# Altium schematic sheet MCU047F_Main.SchDoc: Main Sheet
size 558 x 431 mm; Date: Not shown in title block; ApprovedBy: Not shown in title block; CheckedBy: Not shown in title block; Author: Not shown in title block; CompanyName: Not shown in title block; Engineer: Not shown in title block; Organization: Not shown in title block; Address1: Not shown in title block; Address2: Not shown in title block; Address3: Not shown in title block; Address4: Not shown in title block; DocumentNumber: 1; Revision: Use project parameter SCH_Rev; SheetNumber: 1; SheetTotal: 2; PageSetup: Record=PageOptions|CenterHorizontal=True|CenterVertical=True|PrintScale=1.00|XCorrection=1.00|YCorrection=1.00|PrintKind=0|BorderSize=5000000|LeftOffset=0|BottomOffset=0|Orientation=2|PaperLength=1000|PaperWidth=1000|Scale=100|PaperSource=15|PrintQuality=600|MediaType=1|DitherType=10|PaperKind=Letter|PrintScaleMode=1; CurrentTime: Not shown in title block; CurrentDate: Not shown in title block; Time: Not shown in title block; DocumentFullPathAndName: Not shown in title block; DocumentName: Not shown in title block; ModifiedDate: Not shown in title block; ImagePath: Not shown in title block
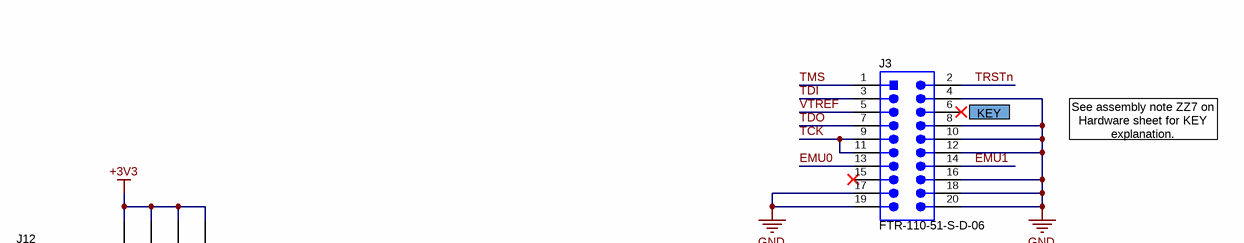
[diagram p0: MCU047F_Main.SchDoc, top left]
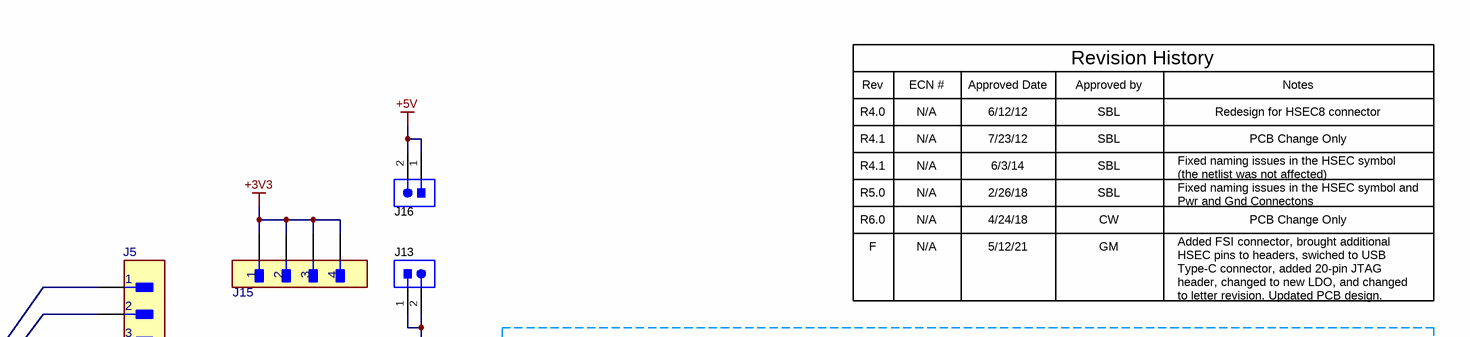
[diagram p1: MCU047F_Main.SchDoc, top right]
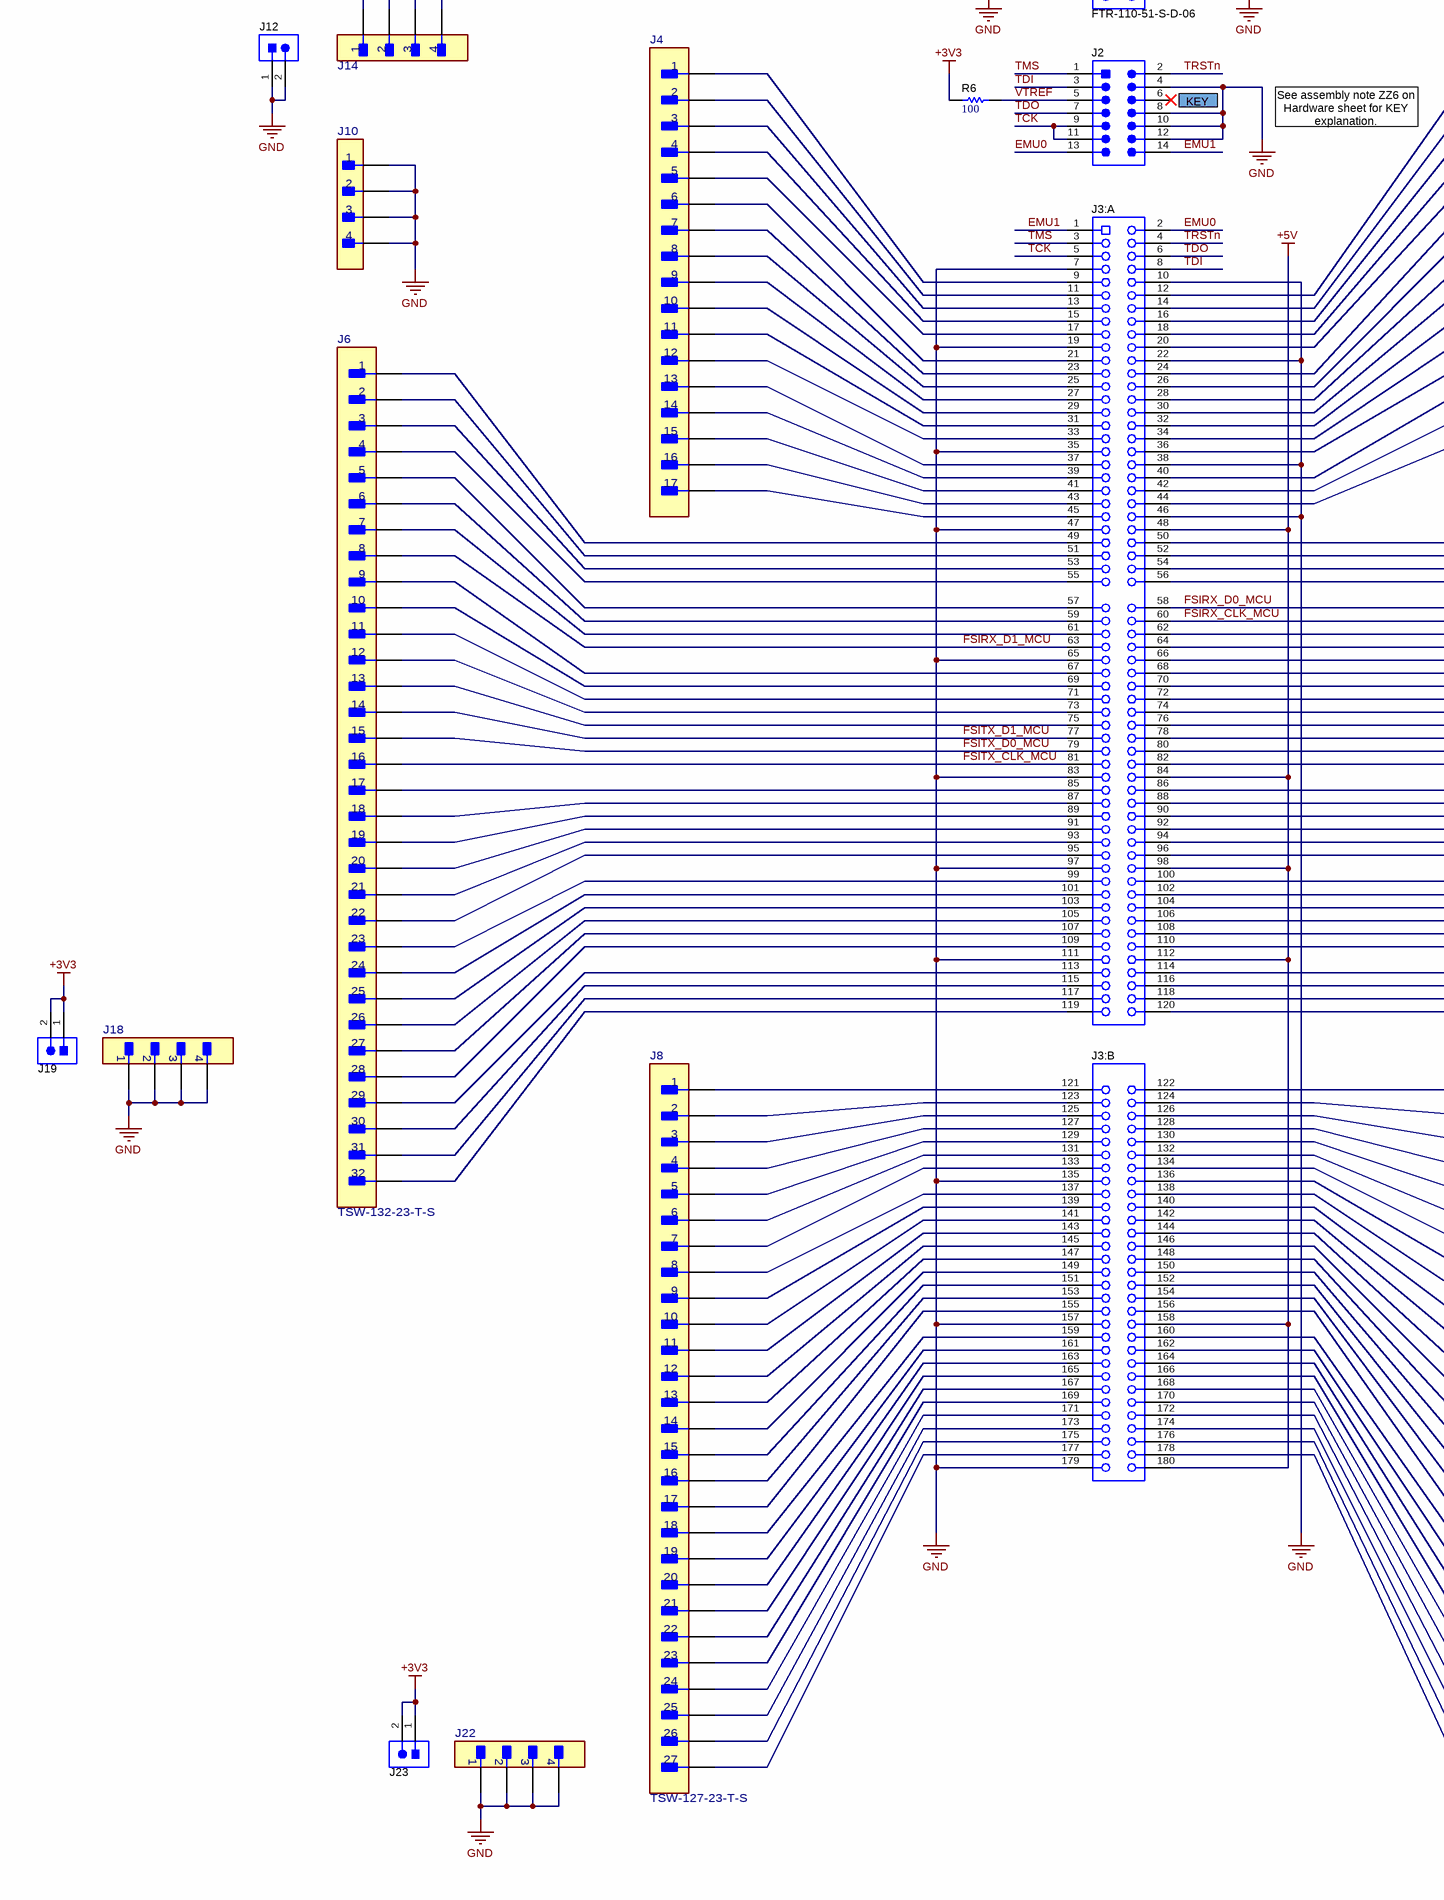
[diagram p2: MCU047F_Main.SchDoc, bottom left]
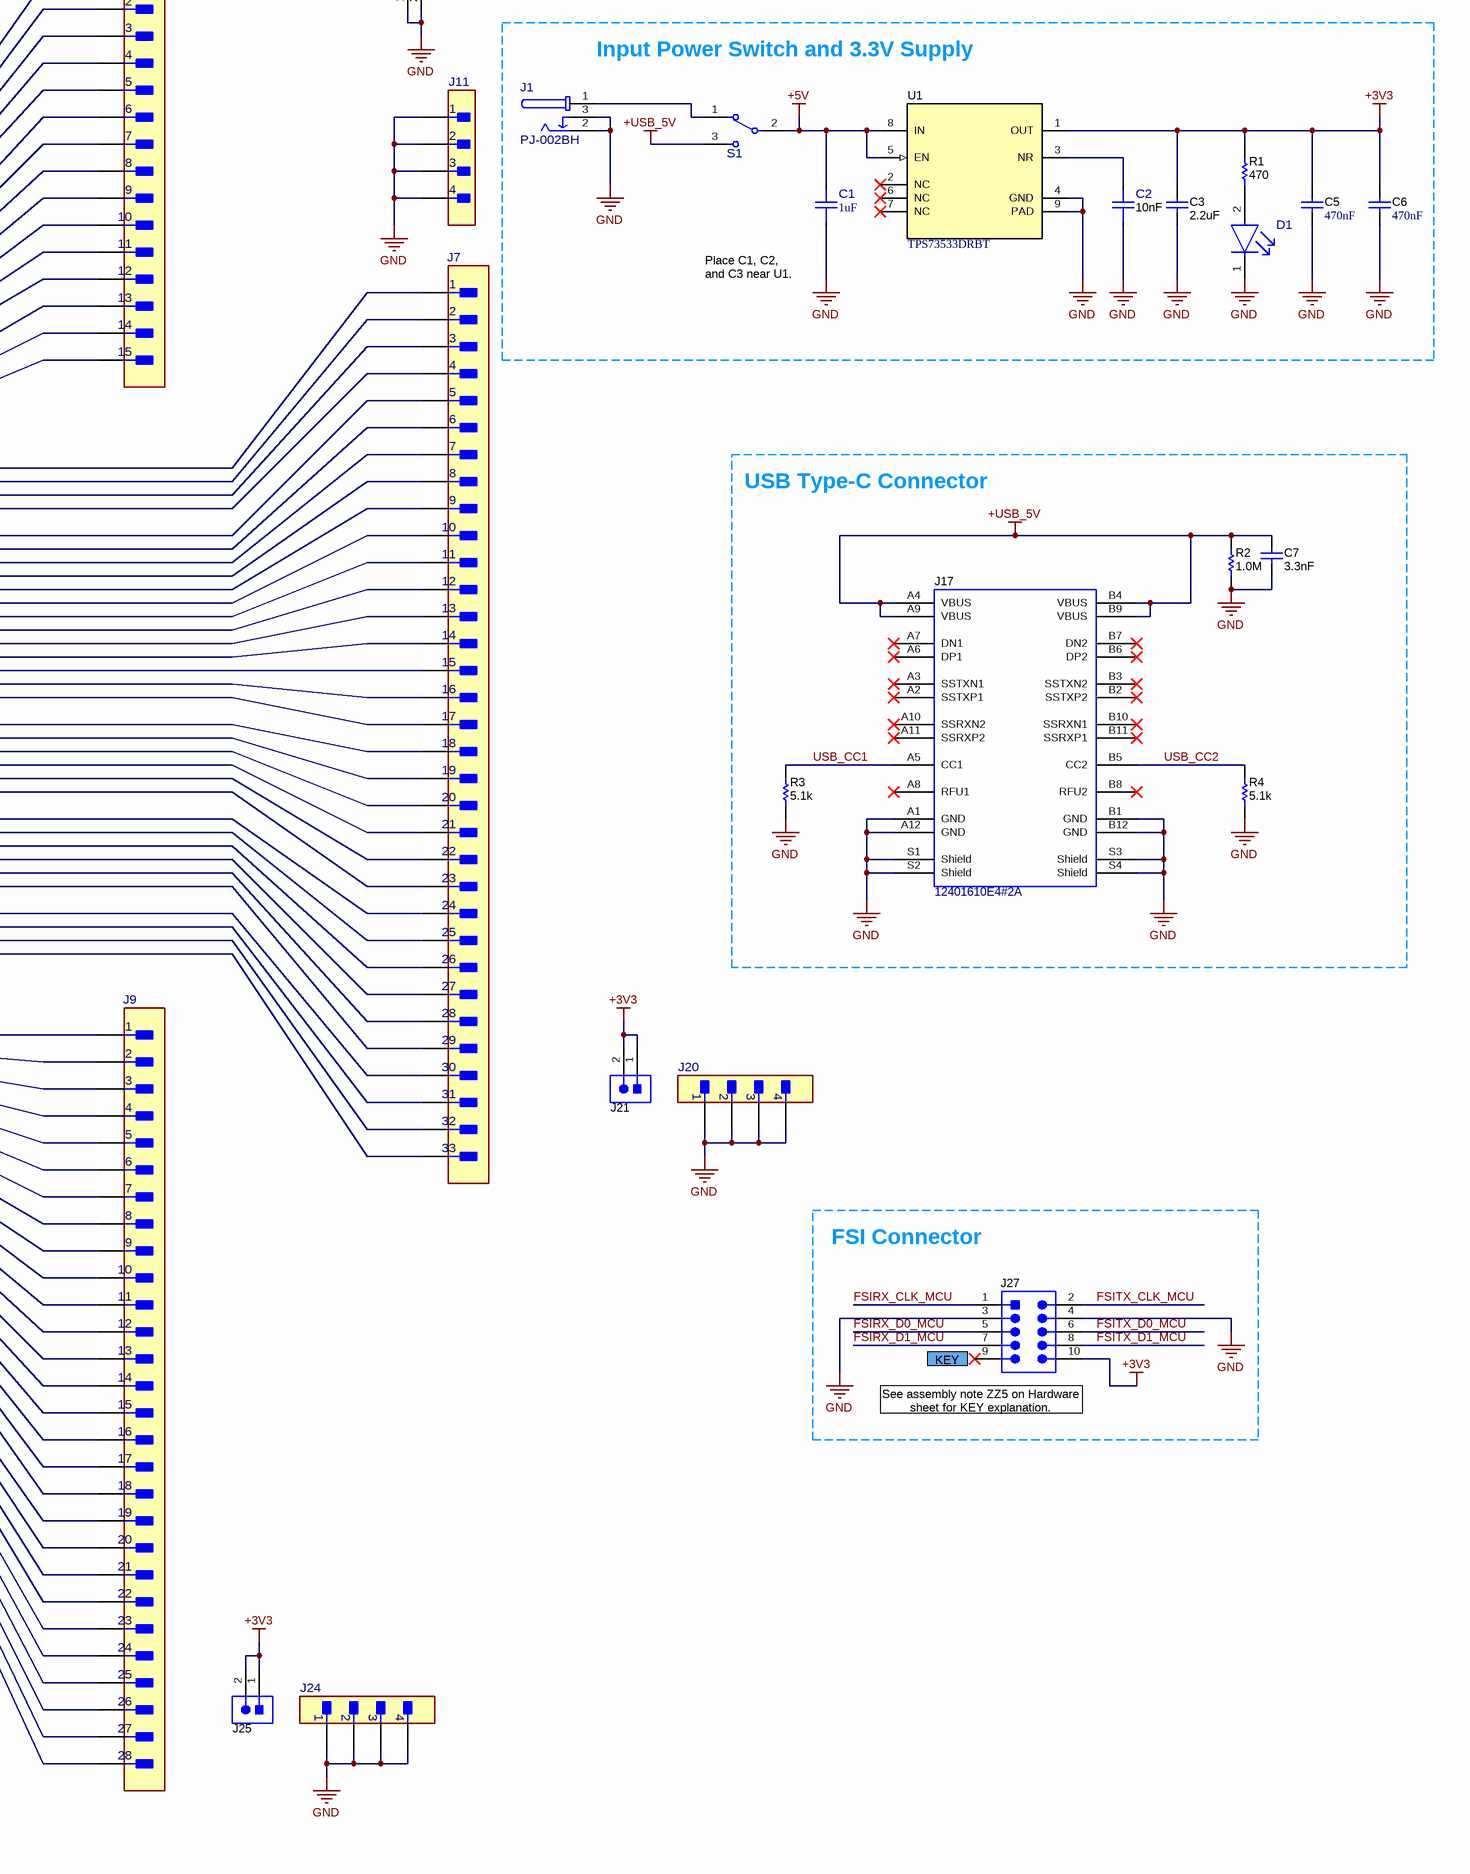
[diagram p3: MCU047F_Main.SchDoc, bottom right]

## Parts
C1  ValueDisplayed: 1uF  [FP-C0603C105K8PAC7411_0603-MFG]  (hidden comment: C0603C105K8PAC7411)
C2  Cap_F: 10nF  [FP-C0603C103K9RACTU_0603-MFG]  (hidden comment: C0603C103K9RACTU)
C3  ValueDisplayed: 2.2uF  [0603]  (hidden comment: JMK107BJ225KAHT)
C5  Cap_F: 470nF  [0805_HV]  (hidden comment: 0805YC474KAT2A)
C6  Cap_F: 470nF  [0805_HV]  (hidden comment: 0805YC474KAT2A)
C7  Cap_F: 3.3nF  [0805_HV]  (hidden comment: C0805C332K5RACTU)
D1  PG1112H-TR  [FP-PG1112H-TR_0805-MFG]  (value not drawn)
J1  PJ-002BH  [FP-PJ-002BH_PTH_POWER_CONN_14MM4_9MM0-MFG]
J2  61301421121  [Wurth_61301421121]  (value not drawn)
J3  FTR-110-51-S-D-06  [Samtec_FTR-110-51-x-D-06]
J3:A  HSEC8-160-01-L-DV-A-BL  [controlCARD-120HSEC]  (value not drawn)
J3:B  HSEC8-130-01-L-DV-A  [controlCARD-180HSEC-60pinAddon]  (value not drawn)
J4  TSW-117-23-T-S  [FP-TSW-117-23-T-S_HDR17-MFG]  (value not drawn)
J5  TSW-115-23-T-S  [FP-TSW-115-23-T-S_HDR15-MFG]  (value not drawn)
J6  TSW-132-23-T-S  [FP-TSW-132-23-T-S_HDR32-MFG]
J7  TSW-133-23-T-S  [FP-TSW-133-23-T-S_HDR33-MFG]  (value not drawn)
J8  TSW-127-23-T-S  [FP-TSW-127-23-T-S_HDR27-MFG]
J9  TSW-128-23-T-S  [FP-TSW-128-23-T-S_HDR28-0]  (value not drawn)
J10  TSW-104-23-T-S  [FP-TSW-104-23-T-S_HDR4-MFG]  (value not drawn)
J11  TSW-104-23-T-S  [FP-TSW-104-23-T-S_HDR4-MFG]  (value not drawn)
J12  TSW-102-23-T-S  [Samtec_TSW-102-23-X-S]  (value not drawn)
J13  TSW-102-23-T-S  [Samtec_TSW-102-23-X-S]  (value not drawn)
J14  TSW-104-23-T-S  [FP-TSW-104-23-T-S_HDR4-MFG]  (value not drawn)
J15  TSW-104-23-T-S  [FP-TSW-104-23-T-S_HDR4-MFG]  (value not drawn)
J16  TSW-102-23-T-S  [Samtec_TSW-102-23-X-S]  (value not drawn)
J17  12401610E4#2A  [Amphenol_12401610E4_2A]
J18  TSW-104-23-T-S  [FP-TSW-104-23-T-S_HDR4-MFG]  (value not drawn)
J19  TSW-102-23-T-S  [Samtec_TSW-102-23-X-S]  (value not drawn)
J20  TSW-104-23-T-S  [FP-TSW-104-23-T-S_HDR4-MFG]  (value not drawn)
J21  TSW-102-23-T-S  [Samtec_TSW-102-23-X-S]  (value not drawn)
J22  TSW-104-23-T-S  [FP-TSW-104-23-T-S_HDR4-MFG]  (value not drawn)
J23  TSW-102-23-T-S  [Samtec_TSW-102-23-X-S]  (value not drawn)
J24  TSW-104-23-T-S  [FP-TSW-104-23-T-S_HDR4-MFG]  (value not drawn)
J25  TSW-102-23-T-S  [Samtec_TSW-102-23-X-S]  (value not drawn)
J27  TSW-105-07-G-D  [TSW-105-07-G-D]  (value not drawn)
R1  ValueDisplayed: 470  [0805_HV]  (hidden comment: ERJ-6GEYJ471V)
R2  ValueDisplayed: 1.0M  [0805_HV]  (hidden comment: ERJ-6GEYJ105V)
R3  ValueDisplayed: 5.1k  [0805_HV]  (hidden comment: ERJ-6GEYJ512V)
R4  ValueDisplayed: 5.1k  [0805_HV]  (hidden comment: ERJ-6GEYJ512V)
R6  ValueDisplayed: 100  [0805_HV]  (hidden comment: ERJ-6GEYJ101V)
S1  200AWMSP1T1A1M2QE  [FP-200AWMSP1T1A1M2QE_PTH_SW_8MM13_5MM08-MFG]  (value not drawn)
U1  TPS73533DRBT  [DRB0008A]

## Nets
+3V3: C3.2 C5.1 C6.1 J14.1 J14.2 J14.3 J14.4 J15.1 J15.2 J15.3 J15.4 J19.1 J19.2 J21.1 J21.2 J23.1 J23.2 J25.1 J25.2 J27.10 R1.2 R6.1 U1.1(OUT)
+5V: C1.2 J3:A.48 J3:A.84 J3:A.98 J3:A.112 J3:B.158 J3:B.180 J16.1 J16.2 S1.2(COM) U1.5(EN) U1.8(IN)
+USB_5V: C7.1 J17.A4(VBUS) J17.A9(VBUS) J17.B4(VBUS) J17.B9(VBUS) R2.2 S1.3
GND: C1.1 C2.1 C3.1 C5.2 C6.2 C7.2 D1.1(CATHODE) J1.2 J1.3 J2.4 J2.8 J2.10 J2.12 J3.4 J3.8 J3.10 J3.12 J3.16 J3.17 J3.18 J3.19 J3.20 J3:A.7 J3:A.10 J3:A.19 J3:A.22 J3:A.35 J3:A.38 J3:A.46 J3:A.47 J3:A.65 J3:A.83 J3:A.97 J3:A.111 J3:B.135 J3:B.157 J3:B.179 J10.1 J10.2 J10.3 J10.4 J11.1 J11.2 J11.3 J11.4 J12.1 J12.2 J13.1 J13.2 J17.A1(GND) J17.A12(GND) J17.B1(GND) J17.B12(GND) J17.S1(Shield) J17.S2(Shield) J17.S3(Shield) J17.S4(Shield) J18.1 J18.2 J18.3 J18.4 J20.1 J20.2 J20.3 J20.4 J22.1 J22.2 J22.3 J22.4 J24.1 J24.2 J24.3 J24.4 J27.3 J27.4 R2.1 R3.1 R4.1 U1.4(GND) U1.9(PAD)
EMU0: J2.13 J3.13 J3:A.2
EMU1: J2.14 J3.14 J3:A.1
FSIRX_CLK_MCU: J3:A.60 J7.6 J27.1
FSIRX_D0_MCU: J3:A.58 J7.5 J27.5
FSIRX_D1_MCU: J3:A.63 J6.8 J27.7
FSITX_CLK_MCU: J3:A.81 J6.16 J27.2
FSITX_D0_MCU: J3:A.79 J6.15 J27.6
FSITX_D1_MCU: J3:A.77 J6.14 J27.8
TCK: J2.9 J2.11 J3.9 J3.11 J3:A.5
TDI: J2.3 J3.3 J3:A.8
TDO: J2.7 J3.7 J3:A.6
TMS: J2.1 J3.1 J3:A.3
TRSTn: J2.2 J3.2 J3:A.4
USB_CC1: J17.A5(CC1) R3.2
USB_CC2: J17.B5(CC2) R4.2
VTREF: J2.5 J3.5 R6.2
NetC2_2: C2.2 U1.3(NR)
NetD1_2: D1.2(ANODE) R1.1
NetJ1_1: J1.1 S1.1
NetJ3:A_9: J3:A.9 J4.1
NetJ3:A_11: J3:A.11 J4.2
NetJ3:A_12: J3:A.12 J5.1
NetJ3:A_13: J3:A.13 J4.3
NetJ3:A_14: J3:A.14 J5.2
NetJ3:A_15: J3:A.15 J4.4
NetJ3:A_16: J3:A.16 J5.3
NetJ3:A_17: J3:A.17 J4.5
NetJ3:A_18: J3:A.18 J5.4
NetJ3:A_20: J3:A.20 J5.5
NetJ3:A_21: J3:A.21 J4.6
NetJ3:A_23: J3:A.23 J4.7
NetJ3:A_24: J3:A.24 J5.6
NetJ3:A_25: J3:A.25 J4.8
NetJ3:A_26: J3:A.26 J5.7
NetJ3:A_27: J3:A.27 J4.9
NetJ3:A_28: J3:A.28 J5.8
NetJ3:A_29: J3:A.29 J4.10
NetJ3:A_30: J3:A.30 J5.9
NetJ3:A_31: J3:A.31 J4.11
NetJ3:A_32: J3:A.32 J5.10
NetJ3:A_33: J3:A.33 J4.12
NetJ3:A_34: J3:A.34 J5.11
NetJ3:A_36: J3:A.36 J5.12
NetJ3:A_37: J3:A.37 J4.13
NetJ3:A_39: J3:A.39 J4.14
NetJ3:A_40: J3:A.40 J5.13
NetJ3:A_41: J3:A.41 J4.15
NetJ3:A_42: J3:A.42 J5.14
NetJ3:A_43: J3:A.43 J4.16
NetJ3:A_44: J3:A.44 J5.15
NetJ3:A_45: J3:A.45 J4.17
NetJ3:A_49: J3:A.49 J6.1
NetJ3:A_50: J3:A.50 J7.1
NetJ3:A_51: J3:A.51 J6.2
NetJ3:A_52: J3:A.52 J7.2
NetJ3:A_53: J3:A.53 J6.3
NetJ3:A_54: J3:A.54 J7.3
NetJ3:A_55: J3:A.55 J6.4
NetJ3:A_56: J3:A.56 J7.4
NetJ3:A_57: J3:A.57 J6.5
NetJ3:A_59: J3:A.59 J6.6
NetJ3:A_61: J3:A.61 J6.7
NetJ3:A_62: J3:A.62 J7.7
NetJ3:A_64: J3:A.64 J7.8
NetJ3:A_66: J3:A.66 J7.9
NetJ3:A_67: J3:A.67 J6.9
NetJ3:A_68: J3:A.68 J7.10
NetJ3:A_69: J3:A.69 J6.10
NetJ3:A_70: J3:A.70 J7.11
NetJ3:A_71: J3:A.71 J6.11
NetJ3:A_72: J3:A.72 J7.12
NetJ3:A_73: J3:A.73 J6.12
NetJ3:A_74: J3:A.74 J7.13
NetJ3:A_75: J3:A.75 J6.13
NetJ3:A_76: J3:A.76 J7.14
NetJ3:A_78: J3:A.78 J7.15
NetJ3:A_80: J3:A.80 J7.16
NetJ3:A_82: J3:A.82 J7.17
NetJ3:A_85: J3:A.85 J6.17
NetJ3:A_86: J3:A.86 J7.18
NetJ3:A_87: J3:A.87 J6.18
NetJ3:A_88: J3:A.88 J7.19
NetJ3:A_89: J3:A.89 J6.19
NetJ3:A_90: J3:A.90 J7.20
NetJ3:A_91: J3:A.91 J6.20
NetJ3:A_92: J3:A.92 J7.21
NetJ3:A_93: J3:A.93 J6.21
NetJ3:A_94: J3:A.94 J7.22
NetJ3:A_95: J3:A.95 J6.22
NetJ3:A_96: J3:A.96 J7.23
NetJ3:A_99: J3:A.99 J6.23
NetJ3:A_100: J3:A.100 J7.24
NetJ3:A_101: J3:A.101 J6.24
NetJ3:A_102: J3:A.102 J7.25
NetJ3:A_103: J3:A.103 J6.25
NetJ3:A_104: J3:A.104 J7.26
NetJ3:A_105: J3:A.105 J6.26
NetJ3:A_106: J3:A.106 J7.27
NetJ3:A_107: J3:A.107 J6.27
NetJ3:A_108: J3:A.108 J7.28
NetJ3:A_109: J3:A.109 J6.28
NetJ3:A_110: J3:A.110 J7.29
NetJ3:A_113: J3:A.113 J6.29
NetJ3:A_114: J3:A.114 J7.30
NetJ3:A_115: J3:A.115 J6.30
NetJ3:A_116: J3:A.116 J7.31
NetJ3:A_117: J3:A.117 J6.31
NetJ3:A_118: J3:A.118 J7.32
NetJ3:A_119: J3:A.119 J6.32
NetJ3:A_120: J3:A.120 J7.33
NetJ3:B_121: J3:B.121 J8.1
NetJ3:B_122: J3:B.122 J9.1
NetJ3:B_123: J3:B.123 J8.2
NetJ3:B_124: J3:B.124 J9.2
NetJ3:B_125: J3:B.125 J8.3
NetJ3:B_126: J3:B.126 J9.3
NetJ3:B_127: J3:B.127 J8.4
NetJ3:B_128: J3:B.128 J9.4
NetJ3:B_129: J3:B.129 J8.5
NetJ3:B_130: J3:B.130 J9.5
NetJ3:B_131: J3:B.131 J8.6
NetJ3:B_132: J3:B.132 J9.6
NetJ3:B_133: J3:B.133 J8.7
NetJ3:B_134: J3:B.134 J9.7
NetJ3:B_136: J3:B.136 J9.8
NetJ3:B_137: J3:B.137 J8.8
NetJ3:B_138: J3:B.138 J9.9
NetJ3:B_139: J3:B.139 J8.9
NetJ3:B_140: J3:B.140 J9.10
NetJ3:B_141: J3:B.141 J8.10
NetJ3:B_142: J3:B.142 J9.11
NetJ3:B_143: J3:B.143 J8.11
NetJ3:B_144: J3:B.144 J9.12
NetJ3:B_145: J3:B.145 J8.12
NetJ3:B_146: J3:B.146 J9.13
NetJ3:B_147: J3:B.147 J8.13
NetJ3:B_148: J3:B.148 J9.14
NetJ3:B_149: J3:B.149 J8.14
NetJ3:B_150: J3:B.150 J9.15
NetJ3:B_151: J3:B.151 J8.15
NetJ3:B_152: J3:B.152 J9.16
NetJ3:B_153: J3:B.153 J8.16
NetJ3:B_154: J3:B.154 J9.17
NetJ3:B_155: J3:B.155 J8.17
NetJ3:B_156: J3:B.156 J9.18
NetJ3:B_159: J3:B.159 J8.18
NetJ3:B_160: J3:B.160 J9.19
NetJ3:B_161: J3:B.161 J8.19
NetJ3:B_162: J3:B.162 J9.20
NetJ3:B_163: J3:B.163 J8.20
NetJ3:B_164: J3:B.164 J9.21
NetJ3:B_165: J3:B.165 J8.21
NetJ3:B_166: J3:B.166 J9.22
NetJ3:B_167: J3:B.167 J8.22
NetJ3:B_168: J3:B.168 J9.23
NetJ3:B_169: J3:B.169 J8.23
NetJ3:B_170: J3:B.170 J9.24
NetJ3:B_171: J3:B.171 J8.24
NetJ3:B_172: J3:B.172 J9.25
NetJ3:B_173: J3:B.173 J8.25
NetJ3:B_174: J3:B.174 J9.26
NetJ3:B_175: J3:B.175 J8.26
NetJ3:B_176: J3:B.176 J9.27
NetJ3:B_177: J3:B.177 J8.27
NetJ3:B_178: J3:B.178 J9.28

Not connected (* = marked no-connect by the designer): J2 6*; J3 6* 15*; J17 A2(SSTXP1)* A3(SSTXN1)* A6(DP1)* A7(DN1)* A8(RFU1)* A10(SSRXN2)* A11(SSRXP2)* B2(SSTXP2)* B3(SSTXN2)* B6(DP2)* B7(DN2)* B8(RFU2)* B10(SSRXN1)* B11(SSRXP1)*; J27 9*; U1 2(NC)* 6(NC)* 7(NC)*

## Notes on the sheet
- Rev
- ECN #
- Approved Date
- Approved by
- Revision History
- Notes
- (near J3) KEY
- See assembly note ZZ7 on Hardware sheet for KEY explanation.
- R4.1
- R4.0
- N/A
- 6/3/14
- 6/12/12
- 7/23/12
- SBL
- Redesign for HSEC8 connector
- PCB Change Only
- R5.0
- R6.0
- 2/26/18
- 4/24/18
- CW
- Fixed naming issues in the HSEC symbol
  (the netlist was not affected)
- Fixed naming issues in the HSEC symbol and Pwr and Gnd Connectons
- F
- 5/12/21
- GM
- Added FSI connector, brought additional HSEC pins to headers, swiched to USB Type-C connector, added 20-pin JTAG header, changed to new LDO, and changed to letter revision. Updated PCB design.
- (near J2) KEY
- See assembly note ZZ6 on Hardware sheet for KEY explanation.
- Input Power Switch and 3.3V Supply
- (near C1) Place C1, C2, and C3 near U1.
- USB Type-C Connector
- FSI Connector
- (near J27) See assembly note ZZ5 on Hardware sheet for KEY explanation.
- (near J27) KEY
- Drawn By:
- SVN Rev:
- Number:
- TID #:
- Orderable:
- Rev:
- Sheet Title:
- File:
- Project Title:
- Designed for:
- Assembly Variant:
- Mod. Date:
- Sheet:
- Size:
- of
- C
- http://www.ti.com
- Texas Instruments and/or its licensors do not warrant the accuracy or completeness of this specification or any information contained therein. Texas Instruments and/or its licensors do not warrant that this design will meet the specifications, will be suitable for your application or fit for any particular purpose, or will operate in an implementation. Texas Instruments and/or its licensors do not warrant that the design is production worthy. You should completely validate and test your design implementation to confirm the system functionality for your application.
- Engineer:
- Contact:
- © Texas Instruments

## Library data of the parts
C1 = CMP-0092650-1: 1uF ±10% 10V Ceramic Capacitor X5R 0603 (1608 Metric); Manufacturer: KEMET; TempCo: 15%; Value: 1µF; SizeZ_mm: 0.9mm; AEC Qualified: No; Supplier Part Number 2: 80-C0603C105K8PLR; Supplier 2: Mouser; RoHS: TRUE; Supplier 1: Digikey; PackageReference: 0603; Tolerance_%: 10%; PartNumber: C0603C105K8PAC7411; Cap_F: 1µF; VDC_V: 10V; ComponentLink1Description: Datasheet; Supplier Part Number 1: 399-C0603C105K8PAC7411CT-ND; ComponentLink1URL: https://content.kemet.com/datasheets/KEM_C1006_X5R_SMD.pdf; Digikey Description: CAP CER 1UF 10V X5R 0603; Lead Free: Yes; Operating Temperature Range: -55°C to +85°C; Mouser Description: Cap Ceramic 1uF 10V X5R 10% SMD 0603 85°C Paper T/R; Mouser Part Number: 80-C0603C105K8PLR; Digikey Part Number: 399-C0603C105K8PAC7411CT-ND; helpURL: https://upverter.com/upn/revision/5d383732cde16e16/; datasheet: https://content.kemet.com/datasheets/KEM_C1006_X5R_SMD.pdf; Part Number: C0603C105K8PAC7411; Temperature Characteristic: X5R; Datasheet Path: datasheets/Cap-C0603C105K8PAC7411.pdf
C2 = CMP-0091957-1: 10000pF ±10% 6.3V Ceramic Capacitor X7R 0603 (1608 Metric); Manufacturer: Kemet; AEC Qualified: No; Value: 10nF; ValueDisplayed: 0.01uF; SizeZ_mm: 0.87mm; RoHS: TRUE; Digikey Part Number: 399-8988-1-ND; helpURL: https://upverter.com/upn/revision/0cbf15b84dd4e6ff/; PackageReference: 0603; PartNumber: C0603C103K9RACTU; Supplier 2: Mouser; Digikey Description: CAP CER 10000PF 6.3V X7R 0603; Operating Temperature Range: -55°C to +125°C; Tolerance_%: 10%; ComponentLink1Description: Datasheet; Temperature Characteristic: X7R; Mouser Part Number: 80-C0603C103K9R; VDC_V: 6.3V; Supplier 1: Digikey; datasheet: https://content.kemet.com/datasheets/KEM_C1002_X7R_SMD.pdf; Mouser Description: Multilayer Ceramic Capacitors MLCC - SMD/SMT 6.3volts 10000pF X7R 10%; ComponentLink1URL: https://content.kemet.com/datasheets/KEM_C1002_X7R_SMD.pdf; Supplier Part Number 2: 80-C0603C103K9R; Supplier Part Number 1: 399-8988-1-ND; Datasheet Path: datasheets/Cap-C0603C103K9RACTU.pdf; Lead Free: Yes; Part Number: C0603C103K9RACTU
C3 = CMP-0007504-5: CAP, CERM, 2.2 uF, 6.3 V, +/- 10%, X5R, 0603; Manufacturer: Taiyo Yuden; TaMin_C: -55°C; Polarized: N; SizeAreaWB_mm2: 4.68; Value1: Unknown; U/M: EA; Value: 2.2uF; TaMax_C: 85°C; SizeZ_mm: 1; SizeX_mm: 1.6; SizeY_mm: 0.8; Value2: 6.3V; SizeArea_mm2: 1.28; Cap_F: 2.2µF; AEC Category: Q200; Supplier Part Number 2: 963-JMK107BJ225KAHT; Publisher: Texas Instruments; Supplier 2: Mouser; TempCo: X5R; Published: 2008-06-19; RoHS: Y; MountType: SMT; Supplier 1: Digi-Key; PackageReference: 0603; Tolerance_%: 10%; Cap_Case: 0603; CompType: Capacitor; LatestRevisionDate: 2017-03-09; PartNumber: JMK107BJ225KAHT; AEC Qualified: ?; VDC_V: 6.3V; ComponentLink1Description: Datasheet link; Supplier Part Number 1: 587-3386-1-ND; Technology: Ceramic; ComponentLink1URL: http://www.yuden.co.jp/productdata/catalog/en/mlcc101_e.pdf
C5 C6 = CMP-0007675-2: CAP, CERM, 0.47 uF, 16 V, +/- 10%, X7R, 0805; Manufacturer: AVX; TaMin_C: -55°C; ESR_ohm: 11m; Polarized: N; SizeAreaWB_mm2: 6.75; Value1: 0.011 ohm; U/M: EA; Value: 0.47uF; TaMax_C: 125°C; SizeZ_mm: 1.45; SizeX_mm: 2; SizeY_mm: 1.25; Cap_Case: 0805; Value2: 16V; SizeArea_mm2: 2.5; AEC Category: Q200; Supplier Part Number 2: 96K4765; Publisher: Texas Instruments; Supplier 2: Newark; Supplier Part Number 3: 581-080516C474K; TempCo: X7R; Supplier 3: Mouser; Published: 2008-06-19; RoHS: Y; MountType: SMT; Supplier 1: Digi-Key; PackageReference: 0805; Tolerance_%: 10%; CompType: Capacitor; LatestRevisionDate: 2017-03-09; PartNumber: 0805YC474KAT2A; AEC Qualified: N; VDC_V: 16V; ComponentLink1Description: Datasheet link; AEC Grade: N/A; Supplier Part Number 1: 478-1403-1-ND; Technology: Ceramic; ValueDisplayed: 0.47uF; ComponentLink1URL: http://datasheets.avx.com/X7RDielectric.pdf
C7 = CMP-0007785-2: CAP, CERM, 3300 pF, 50 V, +/- 10%, X7R, 0805; Manufacturer: Kemet; TaMin_C: -55°C; ESR_ohm: 0.332; Polarized: N; SizeAreaWB_mm2: 6.75; Value1: 0.332 ohm; U/M: EA; Value: 3300pF; TaMax_C: 125°C; SizeZ_mm: 1.45; SizeX_mm: 2; SizeY_mm: 1.25; Cap_Case: 0805; Value2: 50V; SizeArea_mm2: 2.5; IRMS_A: 319mA; AEC Category: Q200; Supplier Part Number 2: 64K2930; Publisher: Texas Instruments; Supplier 2: Newark; Supplier Part Number 3: 80-C0805C332K5R; TempCo: X7R; Supplier 3: Mouser; Published: 2008-06-19; RoHS: Y; MountType: SMT; Supplier 1: Digi-Key; PackageReference: 0805; Tolerance_%: 10%; CompType: Capacitor; LatestRevisionDate: 2017-03-09; PartNumber: C0805C332K5RACTU; AEC Qualified: ?; VDC_V: 50V; ComponentLink1Description: Datasheet link; Supplier Part Number 1: 399-1153-1-ND; Technology: Ceramic; ValueDisplayed: 3300pF; ComponentLink1URL: http://www.kemet.com/kemet/web/homepage/kechome.nsf/file/Partial%20Copy%20-%20Ceramic%20Surface%20Mount%20Capacitors/$file/F3102_CE.pdf
D1 = CMP-0091781-1: Green 567nm LED Indication - Discrete 2.1V 0805 (2012 Metric); Manufacturer: Stanley Electric Co; LambdaP: 560nm; SizeZ_mm: 0.9mm; Standoff Height: 0mm; Angle: 160°; Power_TotalModule: 70mW; Luminous Intensity: 6.4mcd; Forward Current: 20mA; Vr_V: 4V; Led Orientation: Top View; AEC Qualified: No; Mouser Part Number: 327-PG1112HTR; PackageReference: 0805; PartNumber: PG1112H-TR; datasheet: https://media.digikey.com/pdf/Data%20Sheets/Stanley%20Electric%20PDFs/BR1112H.pdf; Digikey Part Number: 404-1021-1-ND; Lead Free: yes; Color: Green; ComponentLink1URL: https://media.digikey.com/pdf/Data%20Sheets/Stanley%20Electric%20PDFs/BR1112H.pdf; helpURL: https://upverter.com/upn/revision/9b6f839920567d23/; Digikey Description: LED GREEN DIFFUSED 2125 SMD; ComponentLink1Description: Datasheet; LambdaD: 567nm; Part Number: PG1112H-TR; Vf_V: 2.1V; Operating Temperature Range: -30°C to +85°C; Datasheet Path: datasheets/Diode-PG1112H-TR.pdf; RoHS: TRUE
J1 = CMP-0091947-1: Manufacturer: CUI Devices; AEC Qualified: No; SizeZ_mm: 11.2mm; Conn Orientation: Right Angle; ContactFinish: Nickel; Voltage_V: 24V; Conn Gender: Male; Current_A: 5A; Part Number: PJ-002BH; Supplier Part Number 1: CP-002BH-ND; PackageReference: PTH_POWER_CONN_14MM4_9MM0; PartNumber: PJ-002BH; helpURL: https://upverter.com/upn/revision/c0ec03f34a1cebd9/; Supplier Part Number 2: 490-PJ-002BH; Operating Temperature Range: -25°C to +85°C; Mouser Description: 2.5 x 6.5 mm, 5.0 A, Horizontal, Through Hole, Dc Power Jack Connector; Digikey Description: CONN PWR JACK 2.5X5.5MM SOLDER; Digikey Part Number: CP-002BH-ND; ComponentLink1URL: https://www.cuidevices.com/product/resource/pj-002bh.pdf; Lead Free: Yes; Supplier 2: Mouser; RoHS: TRUE; Supplier 1: Digikey; datasheet: https://www.cuidevices.com/product/resource/pj-002bh.pdf; ComponentLink1Description: Datasheet; Datasheet Path: datasheets/Conn-PJ-002BH.pdf; PinCount: 1; Mouser Part Number: 490-PJ-002BH
J2 = CMP-0086014-1: Header, 2.54mm, 7x2, Gold, TH; Manufacturer: Wurth Elektronik; Pitch_mm: 2.54; Voltage_V: 250V; Shrouded: N; Gender: Male; Current_A: 3A; Cert_UL: Y; Row_Count: 2; CompType: Header; Color: Black; PackageReference: Header, 2.54mm, 7x2, TH; PinCount: 14; Orientation: Vertical; RoHS: Y; RowSpacing_mm: 2.54; ComponentLink1URL: https://katalog.we-online.de/em/datasheet/6130xx21121.pdf; ClassName: Header; ContactFinish: Gold; MountType: TH; ComponentLink1Description: Datasheet URL; PartNumber: 61301421121
J3 = CMP-0075640-2: Header, 1.27mm, 10x2, Tin, SMT; Manufacturer: Samtec; Pitch_mm: 1.27; Gender: Male; Cert_UL: Y; Green_REACh: Passed; Current_A: 3.1A; Shrouded: N; RowSpacing_mm: 2.54; Green_Lifecycle: Active; Row_Count: 2; ComponentLink1Description: Datasheet URL; RoHS: Y; Supplier 1: Digi-Key; Orientation: Vertical; Green_EU RoHS: Passed; PackageReference: Header, 1.27mm, 10x2, SMT; Color: Black; PartNumber: FTR-110-51-S-D-06; PinCount: 20; Supplier Part Number 2: 44W8888; ContactFinish: Tin; Supplier 2: Newark; ClassName: Header; ComponentLink1URL: http://suddendocs.samtec.com/prints/ftr-1xx-xx-xx-d-xx-xx-mkt.pdf; CompType: Header; MountType: SMT; Supplier Part Number 1: SAM8792-ND; Green_EU RoHS-2: Passed
J3:A = CMP-0003814-2: C2000 controlCARD-120HSEC connector, SMT; Manufacturer: Samtec; Note: The pin numbering does not match Samtec datasheet; ComponentLink1URL: http://www.samtec.com/ftppub/pdf/hsec8_dv.pdf; CompType: Connector; PackageReference: C2000 pin numbering; RoHS: Y; MountType: SMT; PartNumber: HSEC8-160-01-L-DV-A-BL; ComponentLink1Description: Datasheet Link
J3:B = CMP-0003859-2: C2000 controlCARD-180HSEC (60-pin addon) connector, SMT; Manufacturer: Samtec; Note: The pin numbering does not match Samtec datasheet; ComponentLink1URL: http://suddendocs.samtec.com/prints/hsec8-1xxx-xx-xx-dv-x-xx-mkt.pdf; CompType: Connector; PackageReference: C2000 pin numbering; RoHS: Y; MountType: SMT; PartNumber: HSEC8-130-01-L-DV-A; ComponentLink1Description: Datasheet Link
J4 = CMP-0091787-1: Conn Unshrouded Header HDR 17 POS 2.54mm Solder ST Thru-Hole; Manufacturer: Samtec; Conn Gender: Male; SizeZ_mm: 8.71mm; ContactFinish: Tin,Nickel; Row_Count: 1; AEC Qualified: No; Conn Orientation: Straight; Supplier 2: Mouser; Datasheet Path: datasheets/Conn-TSW-117-23-T-S.pdf; ComponentLink1Description: Datasheet; ComponentLink1URL: http://suddendocs.samtec.com/catalog_english/tsw_th.pdf; Lead Free: Yes; PackageReference: HDR17; RoHS: TRUE; Digikey Part Number: SAM1075-17-ND; Supplier Part Number 2: 200-TSW11723TS; datasheet: http://suddendocs.samtec.com/catalog_english/tsw_th.pdf; PinCount: 17; Digikey Description: CONN HEADER VERT 17POS 2.54MM; helpURL: https://upverter.com/upn/revision/a7d34796f159d8d7/; Part Number: TSW-117-23-T-S; Mouser Part Number: 200-TSW11723TS; Operating Temperature Range: -55°C to +105°C; PartNumber: TSW-117-23-T-S; DUT-Pitch_mm: 2.54mm; Supplier Part Number 1: SAM1075-17-ND; Supplier 1: Digikey
J5 = CMP-0091786-1: Conn Unshrouded Header HDR 15 POS 2.54mm Solder ST Thru-Hole; Manufacturer: Samtec; Conn Gender: Male; Conn Orientation: Straight; AEC Qualified: No; ContactFinish: Tin,Nickel; SizeZ_mm: 8.71mm; Row_Count: 1; RoHS: TRUE; Supplier 1: Digikey; Digikey Description: CONN HEADER VERT 15POS 2.54MM; datasheet: http://suddendocs.samtec.com/catalog_english/tsw_th.pdf; ComponentLink1Description: Datasheet; Digikey Part Number: SAM1075-15-ND; Supplier Part Number 1: SAM1075-15-ND; Supplier 2: Mouser; ComponentLink1URL: http://suddendocs.samtec.com/catalog_english/tsw_th.pdf; Mouser Part Number: 200-TSW11523TS; Lead Free: Yes; Datasheet Path: datasheets/Conn-TSW-115-23-T-S.pdf; PackageReference: HDR15; PartNumber: TSW-115-23-T-S; Supplier Part Number 2: 200-TSW11523TS; Part Number: TSW-115-23-T-S; Operating Temperature Range: -55°C to +105°C; helpURL: https://upverter.com/upn/revision/69377db6c5ae2c57/; PinCount: 15; DUT-Pitch_mm: 2.54mm
J6 = CMP-0091815-1: Manufacturer: Samtec; Conn Gender: Male; Current_A: 5.7A; Conn Orientation: Straight; AEC Qualified: No; SizeZ_mm: 8.71mm; Row_Count: 1; DUT-Pitch_mm: 2.54mm; ContactFinish: Tin,Nickel; Voltage_V: 550V; datasheet: https://eeconcierge.com/eda/parts/edit/angeldiazmacias/20e822509aaa7eaf/; PartNumber: TSW-132-23-T-S; Supplier 1: Digikey; Supplier 2: Mouser; helpURL: https://upverter.com/upn/revision/598ca0fb0397edfc/; Digikey Description: CONN HEADER VERT 32POS 2.54MM; Digikey Part Number: SAM1075-32-ND; ComponentLink1Description: Datasheet; Mouser Part Number: 200-TSW13223TS; Supplier Part Number 1: SAM1075-32-ND; Supplier Part Number 2: 200-TSW13223TS; ComponentLink1URL: https://eeconcierge.com/eda/parts/edit/angeldiazmacias/20e822509aaa7eaf/; Part Number: TSW-132-23-T-S; PinCount: 32; Datasheet Path: datasheets/Conn-TSW-132-23-T-S.pdf; Operating Temperature Range: -55°C to +105°C; PackageReference: HDR32; Lead Free: Yes; RoHS: TRUE
J7 = CMP-0091789-1: Conn Unshrouded Header HDR 33 POS 2.54mm Solder ST Thru-Hole; Manufacturer: Samtec; Conn Gender: Male; Category 75Fab8F04590Ae3D: Connectors and Adapters; AEC Qualified: No; Category Bda670Ac885E6661: Uncategorized; Row_Count: 1; SizeZ_mm: 8.71mm; Category 0836C53C3D42D3F1: Connectors; Conn Orientation: Straight; Category E7012A0Bd22E3Cc6: Headers & Receptacles; ContactFinish: Tin,Nickel; Operating Temperature Range: -55°C to +105°C; Supplier Part Number 1: SAM1075-33-ND; datasheet: http://suddendocs.samtec.com/catalog_english/tsw_th.pdf; PackageReference: HDR33; Octopart Part Number: 26cbefc533f0f90c; Datasheet Path: datasheets/Conn-TSW-133-23-T-S.pdf; PinCount: 33; ComponentLink1URL: http://suddendocs.samtec.com/catalog_english/tsw_th.pdf; Part Number: TSW-133-23-T-S; Supplier 1: Digikey; PartNumber: TSW-133-23-T-S; Category A3C16Ecb93907806: Uncategorized; Digikey Description: CONN HEADER VERT 33POS 2.54MM; Lead Free: Yes; DUT-Pitch_mm: 2.54mm; ComponentLink1Description: Datasheet; RoHS: TRUE; Digikey Part Number: SAM1075-33-ND; helpURL: https://upverter.com/upn/revision/bac319cef8ced9c1/
J8 = CMP-0091814-1: Manufacturer: Samtec; DUT-Pitch_mm: 2.54mm; AEC Qualified: No; Current_A: 5.7A; SizeZ_mm: 8.71mm; Conn Gender: Male; Conn Orientation: Straight; Row_Count: 1; ContactFinish: Tin,Nickel; Voltage_V: 550V; Supplier Part Number 1: SAM1075-27-ND; Digikey Part Number: SAM1075-27-ND; Datasheet Path: datasheets/Conn-TSW-127-23-T-S.pdf; ComponentLink1URL: http://suddendocs.samtec.com/catalog_english/tsw_th.pdf; Digikey Description: CONN HEADER VERT 27POS 2.54MM; helpURL: https://upverter.com/upn/revision/86296b7f5c0e7200/; PackageReference: HDR27; datasheet: http://suddendocs.samtec.com/catalog_english/tsw_th.pdf; ComponentLink1Description: Datasheet; Supplier 1: Digikey; Part Number: TSW-127-23-T-S; PinCount: 27; RoHS: TRUE; Lead Free: Yes; PartNumber: TSW-127-23-T-S; Operating Temperature Range: -55°C to +105°C
J9 = CMP-0091788-1: Conn Unshrouded Header HDR 28 POS 2.54mm Solder ST Thru-Hole; Manufacturer: Samtec; Category 75Fab8F04590Ae3D: Connectors and Adapters; Category Bda670Ac885E6661: Uncategorized; Category E7012A0Bd22E3Cc6: Headers & Receptacles; Conn Orientation: Straight; Row_Count: 1; SizeZ_mm: 8.71mm; AEC Qualified: No; Conn Gender: Male; ContactFinish: Tin,Nickel; Category 0836C53C3D42D3F1: Connectors; PackageReference: HDR28; Supplier Part Number 1: SAM1075-28-ND; helpURL: https://upverter.com/upn/revision/3586a12066b83dd2/; PartNumber: TSW-128-23-T-S; Operating Temperature Range: -55°C to +105°C; Datasheet Path: datasheets/Conn-TSW-128-23-T-S.pdf; RoHS: TRUE; Digikey Description: CONN HEADER VERT 28POS 2.54MM; ComponentLink1URL: http://suddendocs.samtec.com/catalog_english/tsw_th.pdf; Lead Free: Yes; Category A3C16Ecb93907806: Uncategorized; PinCount: 28; Digikey Part Number: SAM1075-28-ND; Part Number: TSW-128-23-T-S; DUT-Pitch_mm: 2.54mm; Supplier 1: Digikey; Octopart Part Number: 6986a0887cb8b641; ComponentLink1Description: Datasheet; datasheet: http://suddendocs.samtec.com/catalog_english/tsw_th.pdf
J10 J11 J14 J15 J18 J20 J22 J24 = CMP-0091785-1: Conn Unshrouded Header HDR 4 POS 2.54mm Solder ST Thru-Hole; Manufacturer: Samtec; Category 75Fab8F04590Ae3D: Connectors and Adapters; Category 0836C53C3D42D3F1: Connectors; SizeZ_mm: 8.71mm; Category E7012A0Bd22E3Cc6: Headers & Receptacles; Row_Count: 1; AEC Qualified: No; Category A3C16Ecb93907806: Uncategorized; Conn Gender: Male; Conn Orientation: Straight; ContactFinish: Tin,Nickel; Mouser Part Number: 200-TSW10423TS; PackageReference: HDR4; Operating Temperature Range: -55°C to +105°C; Lead Free: Yes; Supplier Part Number 2: 200-TSW10423TS; Part Number: TSW-104-23-T-S; DUT-Pitch_mm: 2.54mm; Digikey Description: CONN HEADER VERT 4POS 2.54MM; helpURL: https://upverter.com/upn/revision/81ae117a183ec43c/; Octopart Part Number: ef462648fa603081; ComponentLink1URL: http://suddendocs.samtec.com/catalog_english/tsw_th.pdf; RoHS: TRUE; Supplier 1: Digikey; Supplier Part Number 1: SAM1075-04-ND; Digikey Part Number: SAM1075-04-ND; PartNumber: TSW-104-23-T-S; Supplier 2: Mouser; datasheet: http://suddendocs.samtec.com/catalog_english/tsw_th.pdf; PinCount: 4; Category Bda670Ac885E6661: Uncategorized; Datasheet Path: datasheets/Conn-TSW-104-23-T-S.pdf; ComponentLink1Description: Datasheet
J12 J13 J16 J19 J21 J23 J25 = CMP-0084558-1: Header, 2.54mm, 2x1, Tin, TH; Manufacturer: Samtec; Cert_UL: Y; Row_Count: 1; Pitch_mm: 2.54; Gender: Male; Current_A: 6.3A; Voltage_V: 550V; Shrouded: N; Color: Black; CompType: Header; ComponentLink1Description: Datasheet URL; Orientation: Vertical; ContactFinish: Tin; PartNumber: TSW-102-23-T-S; PinCount: 2; RoHS: Y; PackageReference: Header, 2.54mm, 2x1, TH; MountType: TH; ComponentLink1URL: http://suddendocs.samtec.com/catalog_english/tsw_th.pdf; ClassName: Header
J17 = CMP-0075218-1: Receptacle, 0.5mm, USB TYPE C, R/A, SMT; Manufacturer: Amphenol Canada; CNHeader: False; Current_A: 5A; Green_Lifecycle: Not Set; Gender: Female; Green_REACh: Incomplete; Row_Count: 2; Pitch_mm: 0.5; ContactFinish: Tin; CT: True; Cert_UL: Y; ComponentLink1URL: https://sps06.itg.ti.com/sites/KMS/crossdivteams/altium/docs/ComponentDatasheets/amphenol_USB Type C Cut Sheet_11.10.15-779978.pdf; Supplier Part Number 2: 523-12401610E4#2A; Publisher: Texas Instruments; Supplier 2: Mouser; Color: Black; RoHS: Y; MountType: SMT; Green_EU RoHS-2: Incomplete; Supplier 1: Digi-Key; Green_EU RoHS: Incomplete; PackageReference: Receptacle, 0.5mm, USB TYPE C, R/A, SMT; PinCount: 24; CompType: USB; LatestRevisionDate: 2017-07-12; PartNumber: 12401610E4#2A; Orientation: R/A; ComponentLink1Description: Datasheet URL; Supplier Part Number 1: 12401610E4#2ACT-ND
J27 = CMP-0075410-2: Header, 100mil, 5x2, Gold, TH; Manufacturer: Samtec; Pitch_mm: 2.54; Cert_VDE: N; Gender: Male; Cert_CSA: Y; Voltage_V: 550V; Green_REACh: Passed; Current_A: 6.3A; Green_Lifecycle: Active; Row_Count: 2; System: Connector; ComponentLink1Description: Datasheet URL; RoHS: Y; Supplier 1: Digi-Key; Cert_UL: Y; Orientation: Vertical; Green_EU RoHS: Passed; PackageReference: 5x2 Header; Color: Black; PartNumber: TSW-105-07-G-D; PinCount: 10; ContactFinish: Gold; Cert_CULUS: N; Shrouded: N; ClassName: Header; RowSpacing_mm: 2.54; ComponentLink1URL: http://samtec.com/ftppub/pdf/TSW_TH.PDF; CompType: Header; MountType: TH; Supplier Part Number 1: SAM1028-05-ND; Green_EU RoHS-2: Passed
R1 = CMP-0020731-3: RES, 470, 5%, 0.125 W, AEC-Q200 Grade 0, 0805; Manufacturer: Panasonic; Power_W: 125mW; TempCo: 200 ppm/C; Value_Code: 470R; Value: 470; EIA_Code: E24; SizeX_mm: 2; SizeY_mm: 1.25; SizeZ_mm: 1.45; Value2: 0.125W; SizeArea_mm2: 2.5; AEC Qualified: Y; VDC_V: 150V; AEC Category: Q200; AEC Grade: 0; SizeAreaWB_mm2: 6.75; Supplier Part Number 2: 667-ERJ-6GEYJ471V; Supplier 2: Mouser; Supplier Part Number 3: 2057693; Supplier 3: Farnell; RoHS: Y; Value1: 5%; MountType: SMT; Supplier 1: Digi-Key; PackageReference: 0805; Tolerance_%: 5%; Res_ohm: 470; CompType: Resistor; PartNumber: ERJ-6GEYJ471V; ComponentLink1Description: Datasheet link; Supplier Part Number 1: P470ACT-ND; Technology: Thick Film; ComponentLink1URL: https://industrial.panasonic.com/cdbs/www-data/pdf/RDA0000/AOA0000C301.pdf
R2 = CMP-0020623-3: RES, 1.0 M, 5%, 0.125 W, AEC-Q200 Grade 0, 0805; Manufacturer: Panasonic; Power_W: 125mW; TempCo: 150 ppm/C; Value_Code: 1M00; Value: 1.0Meg; EIA_Code: E24; Res_ohm: 1M; SizeX_mm: 2; SizeY_mm: 1.25; SizeZ_mm: 1.45; Value2: 0.125W; SizeArea_mm2: 2.5; AEC Qualified: Y; VDC_V: 150V; AEC Category: Q200; AEC Grade: 0; SizeAreaWB_mm2: 6.75; Supplier Part Number 2: 667-ERJ-6GEYJ105V; Supplier 2: Mouser; Supplier Part Number 3: 2057738; Supplier 3: Farnell; RoHS: Y; Value1: 5%; MountType: SMT; Supplier 1: Digi-Key; PackageReference: 0805; Tolerance_%: 5%; CompType: Resistor; PartNumber: ERJ-6GEYJ105V; ComponentLink1Description: Datasheet link; Supplier Part Number 1: P1.0MACT-ND; Technology: Thick Film; ComponentLink1URL: https://industrial.panasonic.com/cdbs/www-data/pdf/RDA0000/AOA0000C301.pdf
R3 R4 = CMP-0020740-3: RES, 5.1 k, 5%, 0.125 W, AEC-Q200 Grade 0, 0805; Manufacturer: Panasonic; Power_W: 125mW; TempCo: 200 ppm/C; Value_Code: 5k10; Value: 5.1k; EIA_Code: E24; SizeX_mm: 2; SizeY_mm: 1.25; SizeZ_mm: 1.45; Value2: 0.125W; SizeArea_mm2: 2.5; AEC Qualified: Y; VDC_V: 150V; AEC Category: Q200; AEC Grade: 0; SizeAreaWB_mm2: 6.75; Supplier Part Number 2: 667-ERJ-6GEYJ512V; Supplier 2: Mouser; Supplier Part Number 3: 2057715; Supplier 3: Farnell; RoHS: Y; Value1: 5%; MountType: SMT; Supplier 1: Digi-Key; PackageReference: 0805; Tolerance_%: 5%; Res_ohm: 5.1k; CompType: Resistor; PartNumber: ERJ-6GEYJ512V; ComponentLink1Description: Datasheet link; Supplier Part Number 1: P5.1KACT-ND; Technology: Thick Film; ComponentLink1URL: https://industrial.panasonic.com/cdbs/www-data/pdf/RDA0000/AOA0000C301.pdf
R6 = CMP-0020618-3: RES, 100, 5%, 0.125 W, AEC-Q200 Grade 0, 0805; Manufacturer: Panasonic; Power_W: 125mW; TempCo: 200 ppm/C; Value_Code: 100R; Value: 100; EIA_Code: E24; SizeX_mm: 2; SizeY_mm: 1.25; SizeZ_mm: 1.45; Value2: 0.125W; SizeArea_mm2: 2.5; AEC Qualified: Y; VDC_V: 150V; AEC Category: Q200; AEC Grade: 0; SizeAreaWB_mm2: 6.75; Supplier Part Number 2: 667-ERJ-6GEYJ101V; Supplier 2: Mouser; Supplier Part Number 3: 2057681; Supplier 3: Farnell; RoHS: Y; Value1: 5%; MountType: SMT; Supplier 1: Digi-Key; PackageReference: 0805; Tolerance_%: 5%; Res_ohm: 100; CompType: Resistor; PartNumber: ERJ-6GEYJ101V; ComponentLink1Description: Datasheet link; Supplier Part Number 1: P100ACT-ND; Technology: Thick Film; ComponentLink1URL: https://industrial.panasonic.com/cdbs/www-data/pdf/RDA0000/AOA0000C301.pdf
S1 = CMP-0091791-1: Toggle Switch SPDT Through Hole  3A 120V; Manufacturer: E-Switch; VDC_V: 28V; AEC Qualified: No; Electromechanical Life: 50000Cycles; SizeZ_mm: 24.2mm; Part Number: 200AWMSP1T1A1M2QE; ComponentLink1Description: Datasheet; PartNumber: 200AWMSP1T1A1M2QE; Supplier 2: Mouser; ComponentLink1URL: http://spec_sheets.e-switch.com/specs/T201104.pdf; Supplier Part Number 2: 612-200AWMSP1T1A1M2Q; datasheet: http://spec_sheets.e-switch.com/specs/T201104.pdf; Datasheet Path: datasheets/Switch-200AWMSP1T1A1M2QE.pdf; Circuit: SPDT; MountType: Through Hole; helpURL: https://upverter.com/upn/revision/92c416902171e46d/; Contact Current Rating: 3A; Lead Free: Yes; Digikey Description: SWITCH TOGGLE SPDT 3A 120V; Mouser Part Number: 612-200AWMSP1T1A1M2Q; Supplier Part Number 1: EG5771-ND; Operating Temperature Range: -30°C to +85°C; Mouser Description: ESWCH 200AWMSP1T1A1M2QE Switches > Toggle > SubMiniature Toggle > Sealed; Supplier 1: Digikey; Digikey Part Number: EG5771-ND; RoHS: TRUE; PackageReference: PTH_SW_8MM13_5MM08
U1 = CMP-0036329-3: 500mA, Adjustable, Low Quiescent Current, Low-Noise, High-PSRR, Single-Output LDO Regulator, DRB0008A (VSON-8); Manufacturer: Texas Instruments; AEC Category: Q200; Vout Adj(Max)(V): 3.3; Vdo(Typ)(mV): 280; SizeY_mm: 3.0; Vin(Max)(V): 6.5; Accuracy(%): 2; Vin(Min)(V): 2.7; SizeAreaWB_mm2: 16.0; SizeZ_mm: 1.0; AEC Qualified: N; SizeArea_mm2: 9.0; Iout(Max)(A): 0.5; Rating: Catalog; Iq(Typ)(mA): 0.04; CompType: IC; MountType: SMT; PackageReference: DRB0008A; Fixed Output Options(V): 3.3; RoHS: Y; SizeX_mm: 3.0; ComponentLink2URL: http://www.ti.com/product/tps735; ComponentLink2Description: Product Folder; Operating Temperature Range: -40 to 125 C; PartNumber: TPS73533DRBT; ComponentLink3Description: Online Datasheet; ComponentLink1Description: Datasheet Link; ComponentLink1URL: http://www.ti.com/lit/ds/symlink/tps735.pdf; PackageDescription: VSON-8; Vout Adj(Min)(V): 3.3; ComponentLink3URL: http://www.ti.com/product/tps735/datasheet